# EAGLE design MaESP ESP32-C3 1.3'' OLED V1.1 (EAGLE 6.1)
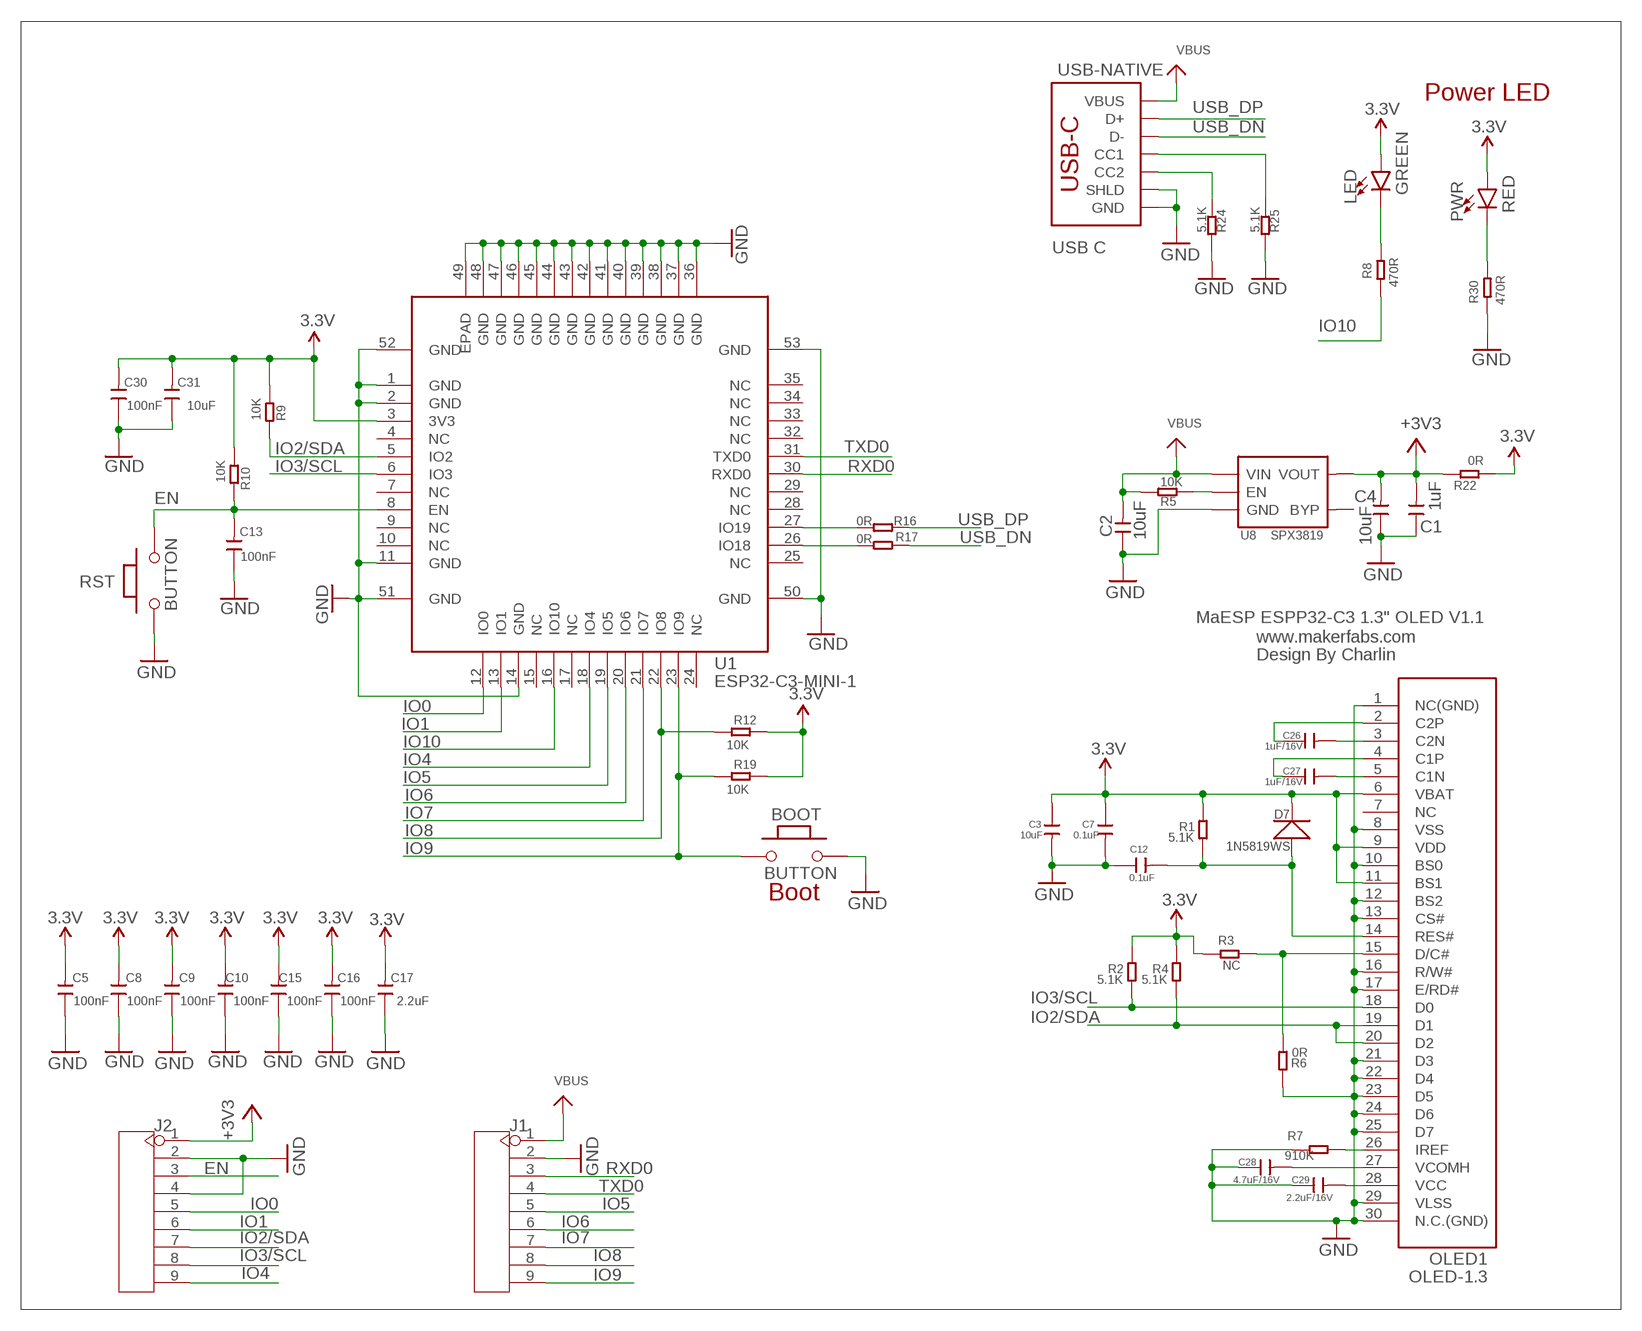
[diagram p0: schematic, sheet 1]

## Parts
BOOT  BUTTON  PB157  [157SW]
C1  1uF  C-0603  [C0603]
C2  10uF  C-0603  [C0603]
C3  10uF  C-0603  [C0603]
C4  10uF  C-0603  [C0603]
C5  100nF  C-0603  [C0603]
C7  0.1uF  C-0603  [C0603]
C8  100nF  C-0603  [C0603]
C9  100nF  C-0603  [C0603]
C10  100nF  C-0603  [C0603]
C12  0.1uF  C-0603  [C0603]
C13  100nF  C-0603  [C0603]
C15  100nF  C-0603  [C0603]
C16  100nF  C-0603  [C0603]
C17  2.2uF  C-0603  [C0603]
C26  1uF/16V  C-0603  [C0603]
C27  1uF/16V  C-0603  [C0603]
C28  4.7uF/16V  C-0603  [C0603]
C29  2.2uF/16V  C-0603  [C0603]
C30  100nF  C-0603  [C0603]
C31  10uF  C-0603  [C0603]
D7  1N5819WS  D'0805'  [SOD323]
J1  HEADER-9P-2.54  [9P-2.54]
J2  HEADER-9P-2.54  [9P-2.54]
LED  GREEN  LED-RED0603  [LED-0603]
OLED1  OLED-1.3  [OLED-1.3]
PWR  RED  LED-RED0603  [LED-0603]
R1  5.1K  R-0603  [R0603]
R2  5.1K  R-0603  [R0603]
R3  NC  R-0603  [R0603]
R4  5.1K  R-0603  [R0603]
R5  10K  R-0603  [R0603]
R6  0R  R-0603  [R0603]
R7  910K  R-0603  [R0603]
R8  470R  R-0603  [R0603]
R9  10K  R-0603  [R0603]
R10  10K  R-0603  [R0603]
R12  10K  R-0603  [R0603]
R16  0R  R-0603  [R0603]
R17  0R  R-0603  [R0603]
R19  10K  R-0603  [R0603]
R22  0R  R-0603  [R0603]
R24  5.1K  R-0603  [R0603]
R25  5.1K  R-0603  [R0603]
R30  470R  R-0603  [R0603]
RST  BUTTON  PB157  [157SW]
U1  ESP32-C3-MINI-1  [ESP32-C3-MINI-1]
U8  SPX3819  [SOT23-5]
USB-NATIVE  USB C  USB_C_4-LAYER-ISOLATED  [USB-C-16P-4LAYER-ISOLATED]

## Nets
3.3V: C3.1 C5.2 C7.1 C8.2 C9.2 C10.2 C15.2 C16.2 C17.2 C30.2 C31.2 D7.- LED.A OLED1.6(VBAT) OLED1.9(VDD) OLED1.11(BS1) PWR.A R1.2 R2.2 R3.2 R4.2 R9.1 R10.1 R12.2 R19.2 R22.1 U1.3(3V3)
3V3_EN: R5.2 U8.3(EN)
+3V3: C1.2 C4.2 J2.1 R22.2 U8.5(VOUT)
EN: C13.2 J2.3 R10.2 RST.2 U1.8(EN)
GND: BOOT.2 C1.1 C2.1 C3.2 C4.1 C5.1 C7.2 C8.1 C9.1 C10.1 C12.1 C13.1 C15.1 C16.1 C17.1 C28.1 C29.1 C30.1 C31.1 J1.2 J2.2 J2.4 OLED1.1(NC(GND)) OLED1.8(VSS) OLED1.10(BS0) OLED1.12(BS2) OLED1.13(CS#) OLED1.16(R/W#) OLED1.17(E/RD#) OLED1.21(D3) OLED1.22(D4) OLED1.23(D5) OLED1.24(D6) OLED1.25(D7) OLED1.29(VLSS) OLED1.30(N.C.(GND)) R6.2 R7.2 R24.1 R25.1 R30.2 RST.1 U1.1(GND) U1.2(GND) U1.11(GND) U1.14(GND) U1.36(GND) U1.37(GND) U1.38(GND) U1.39(GND) U1.40(GND) U1.41(GND) U1.42(GND) U1.43(GND) U1.44(GND) U1.45(GND) U1.46(GND) U1.47(GND) U1.48(GND) U1.49(EPAD) U1.50(GND) U1.51(GND) U1.52(GND) U1.53(GND) U8.2(GND) USB-NATIVE.GND USB-NATIVE.GND2(GND) USB-NATIVE.SHLD1(SHLD) USB-NATIVE.SHLD2(SHLD) USB-NATIVE.SHLD3(SHLD) USB-NATIVE.SHLD4(SHLD) USB-NATIVE.SHLD5(SHLD) USB-NATIVE.SHLD6(SHLD) USB-NATIVE.SHLD7(SHLD) USB-NATIVE.SHLD8(SHLD)
IO0: J2.5 U1.12(IO0)
IO1: J2.6 U1.13(IO1)
IO2/SDA: J2.7 OLED1.19(D1) OLED1.20(D2) R4.1 R9.2 U1.5(IO2)
IO3/SCL: J2.8 OLED1.18(D0) R2.1 U1.6(IO3)
IO4: J2.9 U1.18(IO4)
IO5: J1.5 U1.19(IO5)
IO6: J1.6 U1.20(IO6)
IO7: J1.7 U1.21(IO7)
IO8: J1.8 R12.1 U1.22(IO8)
IO9: BOOT.1 J1.9 R19.1 U1.23(IO9)
IO10: R8.2 U1.16(IO10)
N$1: LED.C R8.1
N$3: OLED1.15(D/C#) R3.1 R6.1
N$5: C28.2 OLED1.27(VCOMH)
N$7: PWR.C R30.1
N$8: C29.2 OLED1.28(VCC)
N$9: OLED1.26(IREF) R7.1
N$10: C26.2 OLED1.3(C2N)
N$11: R25.2 USB-NATIVE.A5(CC1)
N$12: R24.2 USB-NATIVE.B5(CC2)
N$13: C26.1 OLED1.2(C2P)
N$14: C27.1 OLED1.4(C1P)
N$15: C27.2 OLED1.5(C1N)
N$16: R17.1 U1.26(IO18)
N$18: R16.1 U1.27(IO19)
N$20: C12.2 D7.+ OLED1.14(RES#) R1.1
RXD0: J1.3 U1.30(RXD0)
TXD0: J1.4 U1.31(TXD0)
USB_DN: R17.2 USB-NATIVE.A7(D-) USB-NATIVE.B7(D-)
USB_DP: R16.2 USB-NATIVE.A6(D+) USB-NATIVE.B6(D+)
VBUS: C2.2 J1.1 R5.1 U8.1(VIN) USB-NATIVE.VBUS1(VBUS) USB-NATIVE.VBUS2(VBUS)
Unconnected: OLED1.7(NC) U1.4(NC) U1.7(NC) U1.9(NC) U1.10(NC) U1.15(NC) U1.17(NC) U1.24(NC) U1.25(NC) U1.28(NC) U1.29(NC) U1.32(NC) U1.33(NC) U1.34(NC) U1.35(NC) U8.4(BYP)

## Notes on the sheet
- Power LED
- MaESP ESPP32-C3 1.3" OLED V1.1
- www.makerfabs.com
- Design By Charlin
- Boot

## Library data of the parts
BOOT RST = MySMD:PB157
C1-C5 C7-C10 C12 C13 C15-C17 C26-C31 = Discrete:C*: Ceramic Capacitors
D7 = Discrete:D*
J1 J2 = Connector:HEADER-9P
LED = SparkFun-LED:LED-RED: Red SMD LED Used in manufacturing of most products at SparkFun Packages: 0603 - SMD 0603 package [Product Link] <http://docs.avagotech.com/docs/AV02-0551EN> 0603 SMART - SMD 0603 SMART package ( more efficient and expensive)[Product Link] <http://www.osram-os.com/Graphics/XPic2/00077099_0.pdf> 1206 - SMD1206 package [Product Link] <https://www.sparkfun.com/datasheets/DevTools/LilyPad/Q150OVS4.pdff> SparkFun Products: Pro Mini 328 -5V <https://www.sparkfun.com/products/821> RedBoard <https://www.sparkfun.com/products/12757> IOIO-OTG <https://www.sparkfun.com/products/13613>; PROD_ID: DIO-00819; VALUE: RED
OLED1 = OLED:OLED-1.3
PWR = SparkFun-LED:LED-RED: Red SMD LED Used in manufacturing of most products at SparkFun Packages: 0603 - SMD 0603 package [Product Link] <http://docs.avagotech.com/docs/AV02-0551EN> 0603 SMART - SMD 0603 SMART package ( more efficient and expensive)[Product Link] <http://www.osram-os.com/Graphics/XPic2/00077099_0.pdf> 1206 - SMD1206 package [Product Link] <https://www.sparkfun.com/datasheets/DevTools/LilyPad/Q150OVS4.pdff> SparkFun Products: Pro Mini 328 -5V <https://www.sparkfun.com/products/821> RedBoard <https://www.sparkfun.com/products/12757> IOIO-OTG <https://www.sparkfun.com/products/13613>; PROD_ID: DIO-00819
R1-R10 R12 R16 R17 R19 R22 R24 R25 R30 = Discrete:R*
U1 = self:ESP32-C3-MINI-1
U8 = IC:SPX3819
USB-NATIVE = SparkFun-Connectors:USB_C: USB Type C 16Pin Connector Super Speed pins not available on the 16-pin purely SMD connector so this part is best for USB 2.0 implementations. D1 and D2 are tied together enabling D+/- no matter which way the cable is plugged into the connector. The two channel configuration pins (CC1/2) are exposed. These are normally connected to ground via 5.1k resistors but can be reconfigured for high current/high power applications. **4-LAYER BOARD WARNING!!** If designing 4-layer board, make sure to select the variant _4-LAYER-ISOLATED. The linked footprint (USB-C-16-4LAYER-ISOLATED) includes some very necessary cutout polygons in the inner layers (2 and 15). This prevents the PTH mounting shield legs on the USB connector from electrically connecting any other polygons on the inner layers (usually VCC and GND).; PROD_ID: CONN-14122; VALUE: USB Female Type C Connector

## Net classes
0 default: width 0.203 mm, drill 0.305 mm, clearance 0.152 mm
2 Clock: width 0.089 mm, clearance 0.178 mm

## Board
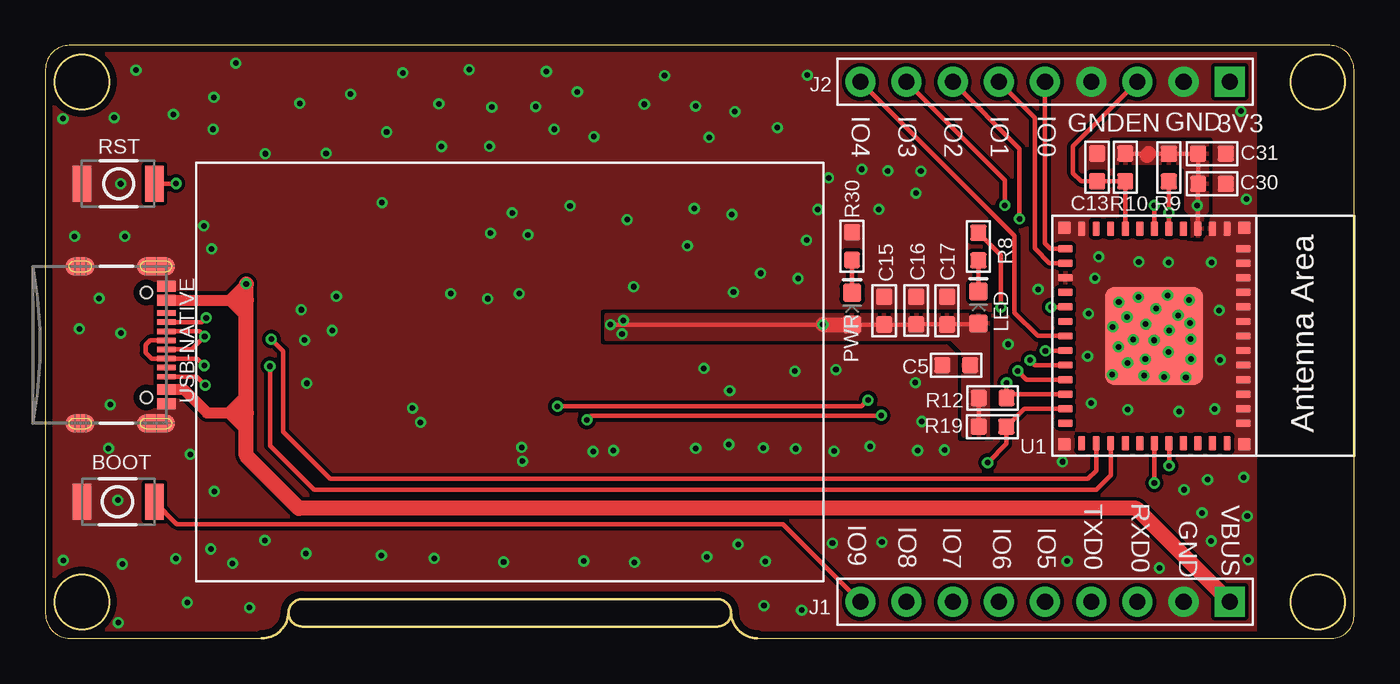
[diagram p1: board, top side]
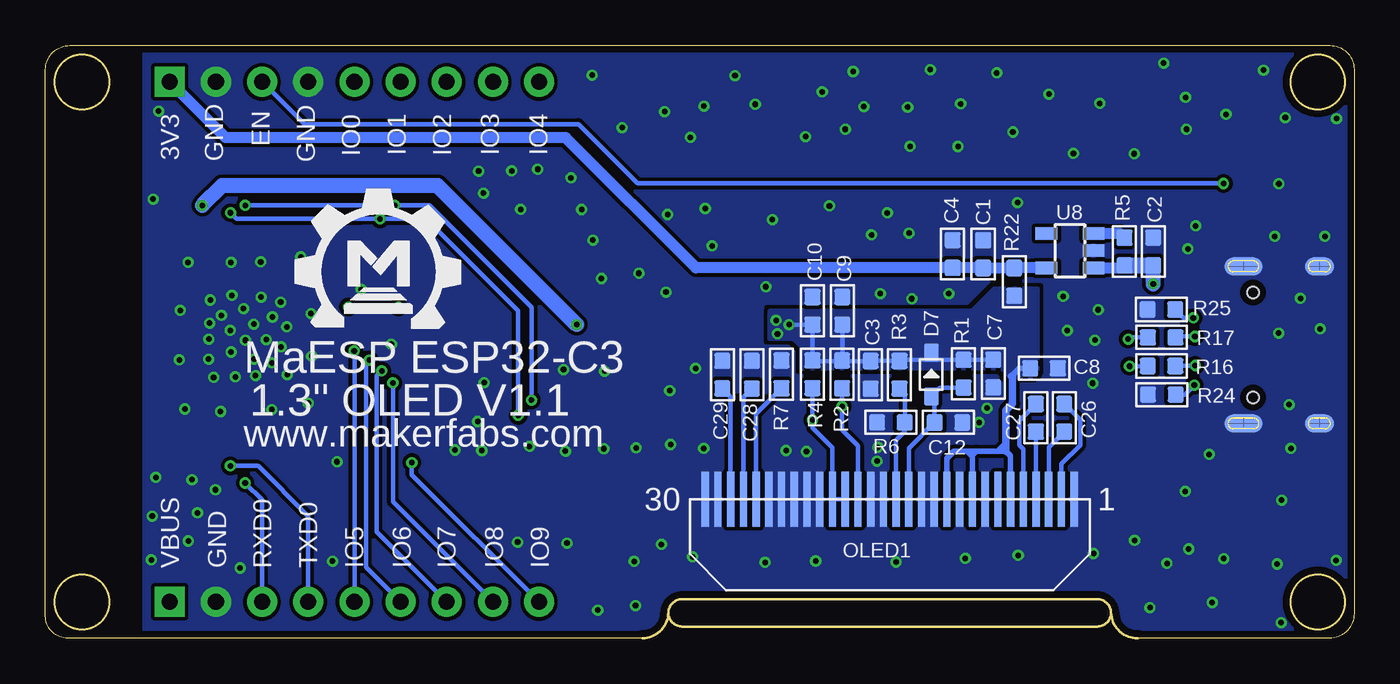
[diagram p2: board, bottom side, seen from below]

Size 72 x 32.6 mm. Coordinates in mm from the lower left corner, seen from the top.
Outline: 13.37,1.42 arc-90 11.89,0 1.35,0 arc-90 0,1.35 0,31.28 arc-90 1.32,32.6 70.66,32.6 arc-90 72,31.26 72,1.22 arc-90 70.78,0 39.15,0 arc-90 37.73,1.42
Outline: circle at 2,2 radius 1.5
Outline: circle at 2,30.6 radius 1.5
Outline: circle at 70,30.6 radius 1.5
Outline: circle at 70,2 radius 1.5
Copper layers (1*16): Top 0.035mm / dielectric 1.5mm / Bottom 0.035mm
Design rules: minimum track width 10mil, minimum drill 8mil, track to track 8mil, track to pad 8mil, pad to pad 8mil, via to via 8mil, smd to smd 0mil, copper to edge 15mil, drill to drill 8mil, minimum pad ring 10mil, minimum via ring 6mil, stop-mask expansion 4mil, vias tented up to drill 100mil, thermal gap 0mil
tRestrict: area 66.7,0 to 72,32.6
bRestrict: area 66.7,0 to 72,32.6

### Footprints (pad centres in the part's own frame; a part is rotated, then mirrored left to right if it is on the bottom)
157SW = smd 1.016 x 1.981: 1 0,0; 2 4,0
C0603 = smd 0.889 x 0.889: 1 -0.762,0; 2 0.762,0
SOD323 = smd 1 x 0.8: + -1.2,0; - 1.2,0
9P-2.54 = drill 0.889 pad 1.651 square: 1 0,10.16 | drill 0.889 pad 1.651: 2 0,7.62; 3 0,5.08; 4 0,2.54; 5 0,0; 6 0,-2.54; 7 0,-5.08; 8 0,-7.62; 9 0,-10.16
LED-0603 = smd 1 x 1: A -0.877,0; C 0.877,0
OLED-1.3 = smd 0.4 x 3 bottom: 1 -10.15,-7; 2 -9.45,-7; 3 -8.75,-7; 4 -8.05,-7; 5 -7.35,-7; 6 -6.65,-7; 7 -5.95,-7; 8 -5.25,-7; 9 -4.55,-7; 10 -3.85,-7; 11 -3.15,-7; 12 -2.45,-7; 13 -1.75,-7; 14 -1.05,-7; 15 -0.35,-7; 16 0.35,-7; 17 1.05,-7; 18 1.75,-7; 19 2.45,-7; 20 3.15,-7; 21 3.85,-7; 22 4.55,-7; 23 5.25,-7; 24 5.95,-7; 25 6.65,-7; 26 7.35,-7; 27 8.05,-7; 28 8.75,-7; 29 9.45,-7; 30 10.15,-7
R0603 = smd 0.889 x 0.889: 1 -0.762,0; 2 0.762,0
ESP32-C3-MINI-1 = smd 0.8 x 0.4: 1 -5.9,1.3; 2 -5.9,0.5; 3 -5.9,-0.3; 4 -5.9,-1.1; 5 -5.9,-1.9; 6 -5.9,-2.7; 7 -5.9,-3.5; 8 -5.9,-4.3; 9 -5.9,-5.1; 10 -5.9,-5.9; 11 -5.9,-6.7; 25 5.9,-6.7; 26 5.9,-5.9; 27 5.9,-5.1; 28 5.9,-4.3; 29 5.9,-3.5; 30 5.9,-2.7; 31 5.9,-1.9; 32 5.9,-1.1; 33 5.9,-0.3; 34 5.9,0.5; 35 5.9,1.3 | smd 0.4 x 0.8: 12 -4.8,-7.6; 13 -4,-7.6; 14 -3.2,-7.6; 15 -2.4,-7.6; 16 -1.6,-7.6; 17 -0.8,-7.6; 18 0,-7.6; 19 0.8,-7.6; 20 1.6,-7.6; 21 2.4,-7.6; 22 3.2,-7.6; 23 4,-7.6; 24 4.8,-7.6; 36 4.8,2.2; 37 4,2.2; 38 3.2,2.2; 39 2.4,2.2; 40 1.6,2.2; 41 0.8,2.2; 42 0,2.2; 43 -0.8,2.2; 44 -1.6,2.2; 45 -2.4,2.2; 46 -3.2,2.2; 47 -4,2.2; 48 -4.8,2.2 | smd 5.4 x 5.4: 49 0,-2.7 | smd 0.7 x 0.7: 50 -5.95,2.25; 51 -5.95,-7.65; 52 5.95,2.25; 53 5.95,-7.65
SOT23-5 = smd 0.69 x 1.2: 1 -0.95,-1.3; 2 0,-1.3; 3 0.95,-1.3; 4 0.95,1.3; 5 -0.95,1.3
USB-C-16P-4LAYER-ISOLATED = smd 0.3 x 1: A5 -1.25,-0.34; A6 -0.25,-0.34; A7 0.25,-0.34; A8 1.25,-0.34; B5 1.75,-0.34; B6 0.75,-0.34; B7 -0.75,-0.34; B8 -1.75,-0.34 | smd 0.6 x 1: GND -3.225,-0.34; GND2 3.225,-0.34; VBUS1 -2.45,-0.34; VBUS2 2.45,-0.34 | smd 1 x 2.1: SHLD1 -4.32,-0.915; SHLD2 4.32,-0.915 | smd 1 x 2.1 bottom: SHLD3 -4.32,-0.915; SHLD4 4.32,-0.915 | smd 1 x 1.6: SHLD5 -4.32,-5.095; SHLD8 4.32,-5.095 | smd 1 x 1.6 bottom: SHLD6 -4.32,-5.095; SHLD7 4.32,-5.095 | hole 0.65: -2.89,-1.445; 2.89,-1.445

### Placement (x,y rotation side)
BOOT  6,7.5 180 top
C1  20.41,21.13 270 bottom
C2  11.05,21.27 270 bottom
C3  26.6,14.48 270 bottom
C4  22.09,21.13 270 bottom
C5  50.11,15.02 0 top
C7  19.85,14.55 270 bottom
C8  17.05,14.85 180 bottom
C9  28.16,18.01 270 bottom
C10  29.8,18.01 270 bottom
C12  22.32,11.87 180 bottom
C13  57.86,25.9 270 top
C15  46.15,18.01 270 top
C16  47.91,18.02 270 top
C17  49.61,18.02 270 top
C26  15.94,12.12 270 bottom
C27  17.51,12.12 90 bottom
C28  33.13,14.49 270 bottom
C29  34.75,14.49 270 bottom
C30  64.18,24.99 180 top
C31  64.18,26.65 180 top
D7  23.26,14.5 90 bottom
J1  55,2 270 top
J2  55,30.6 270 top
LED  51.33,18.19 90 top
OLED1  25.55,14.64 0 top
PWR  44.38,18.13 90 top
R1  21.49,14.54 90 bottom
R2  28.17,14.51 90 bottom
R3  25.01,14.48 90 bottom
R4  29.8,14.51 90 bottom
R5  12.63,21.26 90 bottom
R6  25.48,11.87 180 bottom
R7  31.5,14.51 90 bottom
R8  51.33,21.54 90 top
R9  61.81,25.88 270 top
R10  59.41,25.9 270 top
R12  52.11,13.21 180 top
R16  10.59,14.97 0 bottom
R17  10.59,16.54 0 bottom
R19  52.11,11.63 180 top
R22  18.7,19.6 90 bottom
R24  10.58,13.4 0 bottom
R25  10.6,18.08 0 bottom
R30  44.38,21.56 90 top
RST  2,25 0 top
U1  63.71,16.62 270 top
U8  15.63,21.31 90 bottom
U$1  [MAKERFABS_0.3]  57.8,17.09 0 bottom
USB-NATIVE  7,16.13 270 top

### Tracks (layer width: path | path; a pad name or v marks a point on that pad's centre or on a via)
3.3V  (via drill 0.3)
  Top 0.254: PWR.A C15.2 C16.2 C17.2 51.34,17.25 | U1.3 63.41,24.98 C30.2 C31.2 R9.1 61.8,26.66 60.71,26.66 R10.1 60.62,26.66 | v31.09,17.25 v42.77,17.25 | R19.2 R12.2
  Top 0.813: v42.77,17.25 PWR.A | 60.6,26.55 60.71,26.66
  Bottom 0.254: C7.1 21.48,15.32 R1.2 23.42,15.3 | C3.1 R3.2 24.95,15.3 23.42,15.3 | D7.- 23.26,15.46 23.42,15.3 | C3.1 29.77,15.24 R4.2 C10.2 v31.09,17.24 v31.09,17.25 | C9.2 28.16,15.29 R2.2 28.14,15.24 C3.1
  Bottom 0.305: OLED1.6 18.9,10.04 19.15,10.29 19.58,10.29 | C8.2 18.4,14.85 18.85,14.4 | OLED1.9 21,10.09 20.8,10.29 | 20.8,10.29 19.58,10.29 | 21.29,10.29 20.8,10.29 | 21.01,10.01 21.29,10.29 | OLED1.11 22.4,9.91 22.02,10.29 21.29,10.29 | 19.15,10.72 19.58,10.29
  Bottom 0.406: 19.15,10.29 19.15,12.55 18.8,12.9 18.8,14.35 18.85,14.4
  Bottom 0.813: v42.77,17.25 50.42,24.89 62.28,24.89 v63.37,23.8
  other vias: 31.8,17.48 31.72,16.74
  pour Bottom: 17.42,18 32.13,18 32.16,17.75 32.16,16.46 30.84,16.46 30.4,16.03 30.4,14.83 19.38,14.83 18.92,14.38 17.42,14.38
  pour Top: 51.84,11.15 51.84,17.75 30.86,17.75 30.86,16.46 49.89,16.46 50.5,15.85 50.5,11.15
  pour Top: 63.63,22.12 63.63,23.24 63.91,23.52 63.91,27.23 58.88,27.23 58.88,26.16 62.43,26.16 62.76,25.83 62.76,23.6 63.09,23.27 63.09,22.12
  pour Bottom: 17.42,17.63 17.42,19.23 19.79,19.23 21.01,18.01 21.01,17.63
3V3_EN
  Bottom 0.61: U8.3 12.87,22.26 R5.2
+3V3
  Bottom 0.61: U8.5 R22.2 C1.2 C4.2 36.22,20.37 43.38,27.53 62.09,27.53 J2.1
EN  (via drill 0.3)
  Top 0.254: U1.8 R10.2 C13.2 | C13.2 56.98,25.13 56.54,25.58 56.54,27.06 J2.3 | C13.2 | RST.2 v7.17,25 v7.18,25.01
  Bottom 0.254: v7.18,25.01 39.41,25.01 42.67,28.27 57.75,28.27 J2.3
GND  (via drill 0.3)
  other vias: 25.21,4.19 39.61,4.22 12.08,5.38 10.3,4.11 1.87,17.01 42.49,23.58 47.9,24.48 37.77,23.3 66.07,24.14 41.88,21.89 18.48,4.56 3.48,10.44 57.95,20.98 58.72,17.12 59.84,16.42 62.97,17.33 35.77,29.27 39.53,1.79 62.93,18.6 60.44,14.44 61,16.39 58.69,14.49 26.2,10.49 61.55,14.37 64.34,12.61 62.32,17.76 61.1,18.12 63.01,16.45 59.51,17.67 3.57,12.84 21.65,29.38 4.23,4.08 61.83,16.93 60.14,18.75 59.03,16.03 43.08,25.32 60.53,17.27 3.99,7.59 62.74,14.35 63.03,15.35 41.61,1.55 35.78,10.44 32.4,4.17 61.74,18.85 61.78,15.74 60.52,15.35 21.79,27.04 59.54,15.14 0.99,4.28 36.4,4.48 32,23.02 4.01,0.86 28.86,23.78 36.52,27.55 41.41,19.78 2.96,18.69 21.39,4.38 43.3,5.22 46.35,25.7 31.25,10.32 35.32,21.58 45.37,10.55 59.06,18.48 18.52,23.95 23.32,31.27 19.66,31.09 27.56,31.17 29.26,30.05 34.06,30.94 16.79,29.92 24.56,29.21 24.43,27.05 27.99,27.99 26.97,29.24 30.18,27.58 22.3,18.95 26.06,18.95 9.14,21.41 9.22,27.99 4.14,24.99 4.37,22.1 1.6,22.1 4.98,31.24 3.78,28.63 0.97,28.57 60.16,20.7 61.79,20.67 64.15,20.67 64.58,18.03 64.63,15.31 62.37,12.47 59.55,12.57 57.54,12.92 57.34,15.51 57.39,17.85 57.75,19.81 65.77,28.99 37.86,19.04 45.86,23.58 35.7,23.63 48.17,25.69 41.23,14.69 49.46,10.35 54.62,19.19 36.23,14.84 43.49,14.77 47.86,14.06 7.17,4.38 63.64,6.89 63.94,8.72 14.34,4.66 62.65,8.16 66.18,4.3 64.14,5.34 66.13,6.72 65.92,8.85 47.99,10.32 37.6,10.65 48.21,11.92 15.78,16.92 26.55,22.18 20.2,12.65 44.92,25.79 40.27,28.08 32.95,29.37 37.93,28.96 41.92,30.97 10.47,31.63 7.04,28.81 8.71,22.68 12.09,26.64 4.15,16.78 20.63,11.87 26.24,9.73 30.13,10.27 39.5,10.47 37.65,13.62 39.35,20.07 38.11,5.16 43.39,10.29 41.28,10.42 29.62,4.25 11.23,1.68 7.8,1.96 9.1,4.91 24.33,18.67 24.49,22.28 32.36,19.33 14.38,14.02 46.02,5.28 56.21,4.24 61.29,3.86 55.96,9.7 18.77,27.84 25.68,23.39 15.44,26.67 14,29.41 9.27,29.74 52.97,16.17 14.08,18.06 14.25,16.39 16.01,18.8 7.97,10.11 9.29,8.07
  pour Top (rank 6): -1.27,37.36 75.44,37.36 75.44,-3.17 -1.27,-3.17
  pour Bottom (rank 6): -2.54,35.56 76.2,35.56 76.2,-2.54 -2.54,-2.54
IO0
  Top 0.254: J2.5 55,21.71 55.3,21.41 U1.12
IO1
  Top 0.254: U1.13 55.25,20.62 54.43,21.44 54.43,28.63 J2.6
IO2/SDA  (via drill 0.3)
  Top 0.254: R9.2 U1.5 v61.81,23.4 | v29.79,12 30.03,12.24 v45.99,12.24 v45.99,12.25 | J2.7 53.59,26.93 v53.59,23.06
  Bottom 0.254: OLED1.19 OLED1.20 28.7,10.46 29.8,11.56 | 29.8,11.56 R4.1 | 29.8,11.56 29.79,11.57 v29.79,12 | v45.99,12.25 45.99,18 51.05,23.06 v53.59,23.06 54.69,23.06 61.48,23.06 v61.81,23.4
IO3/SCL  (via drill 0.3)
  Top 0.254: v28.17,12.75 44.91,12.75 v45.26,13.1 | U1.6 v61.01,23.8 v61.01,23.81 | J2.8 52.78,25.2 v52.78,23.81
  Bottom 0.254: OLED1.18 27.3,10.59 28.17,11.46 R2.1 v28.17,12.75 | v45.26,13.1 45.26,18.21 50.86,23.81 v52.78,23.81 53.34,23.81 v61.01,23.81
IO4
  Top 0.254: 56.1,16.61 U1.18 54.6,16.62 53.31,17.91 53.31,22.12 J2.9
IO5  (via drill 0.3)
  Top 0.254: v55.02,15.8 56.09,15.8 U1.19
  Bottom 0.254: J1.5 55,15.78 v55.02,15.8
IO6  (via drill 0.3)
  Top 0.254: U1.20 54.45,15.02 v54.18,15.29
  Bottom 0.254: J1.6 54.36,3.9 54.36,15.11 v54.18,15.29
IO7  (via drill 0.3)
  Top 0.254: U1.21 53.98,14.22 v53.49,14.71
  Bottom 0.254: J1.7 53.77,5.85 53.77,14.43 v53.49,14.71
IO8  (via drill 0.3)
  Top 0.254: v52.88,14.05 52.88,14.04 R12.1 53.09,13.42 U1.22
  Bottom 0.254: J1.8 52.88,7.5 v52.88,14.05
IO9  (via drill 0.3)
  Top 0.254: U1.23 53.86,12.62 R19.1 | 52.86,11.62 R19.1 | J1.9 40.57,6.27 7.23,6.27 BOOT.1 | v51.84,9.65 52.87,10.68 R19.1
  Bottom 0.254: J1.9 51.84,9 v51.84,9.65
IO10  (via drill 0.3)
  Top 0.254: R8.2 52.58,21.06 v52.58,18.21 | v55.32,18.21 56.1,18.21 U1.16
  Bottom 0.254: v52.58,18.21 v55.32,18.21
N$1
  Top 0.254: LED.C R8.1
N$3
  Bottom 0.254: R3.1 24.72,13.43 R6.1 24.72,11.37 25.2,10.89 OLED1.15
N$5
  Bottom 0.254: OLED1.27 33.6,13.26 C28.2
N$7
  Top 0.254: PWR.C R30.1
N$8
  Bottom 0.254: OLED1.28 34.3,13.28 C29.2
N$9
  Bottom 0.254: OLED1.26 32.9,12.35 R7.1
N$10
  Bottom 0.254: OLED1.3 16.8,10.5 C26.2
N$11  (via drill 0.3)
  Top 0.254: USB-NATIVE.A5 8.6,17.38 v8.84,17.62
  Bottom 0.254: R25.2 9.38,17.62 v8.84,17.62
N$12  (via drill 0.3)
  Top 0.254: USB-NATIVE.B5 8.32,14.38 v8.79,13.91
  Bottom 0.254: R24.2 9.31,13.4 v8.79,13.91
N$13
  Bottom 0.254: OLED1.2 16.1,9.58 15.06,10.62 15.06,12 C26.1
N$14
  Bottom 0.254: OLED1.4 17.5,11.35 C27.1
N$15
  Bottom 0.254: OLED1.5 18.2,10.4 18.41,10.62 18.41,11.97 C27.2
N$16  (via drill 0.3)
  Top 0.254: U1.26 57.81,9.21 57.35,8.76 15.67,8.76 13.08,11.34 13.08,15.79 v12.42,16.45
  Bottom 0.254: R17.1 12.33,16.54 v12.42,16.45
N$18  (via drill 0.3)
  Top 0.254: U1.27 58.61,8.96 57.81,8.16 14.78,8.16 12.35,10.59 v12.35,14.96
  Bottom 0.254: R16.1 v12.34,14.97 v12.35,14.96
N$20
  Bottom 0.254: R1.1 22.78,13.78 D7.+ 23.08,13.12 C12.2 24.5,10.44 OLED1.14
RXD0  (via drill 0.3)
  Top 0.254: U1.30 v61.01,8.53
  Bottom 0.254: J1.3 60.08,7.6 v61.01,8.53
TXD0  (via drill 0.3)
  Top 0.254: U1.31 61.82,10.71 v61.82,9.47
  Bottom 0.254: J1.4 57.54,6.71 60.3,9.47 v61.82,9.47
USB_DN  (via drill 0.3)
  Top 0.254: USB-NATIVE.A7 8.05,15.88 v8.76,16.59 8.47,16.88 USB-NATIVE.B7
  Bottom 0.254: v8.76,16.59 9.77,16.59 R17.2
USB_DP  (via drill 0.3)
  Top 0.254: v8.74,15 8.36,15.38 USB-NATIVE.B6 6.65,15.37 5.84,15.37 5.51,15.7 5.51,16.13 5.76,16.38 USB-NATIVE.A6
  Bottom 0.254: v8.74,15 9.8,15 R16.2
VBUS  (via drill 0.3)  (1 unrouted)
  Top 0.61: USB-NATIVE.VBUS2 7.61,13.68 8.89,12.39 10.08,12.39 | 10.08,12.39 11.04,12.39 | USB-NATIVE.VBUS1 11.03,18.58 11.04,18.59 | 11.05,11.43 10.08,12.39 | 10.08,12.39 11.05,13.36 | 11.05,19.51 10.13,18.59 11.05,17.68
  Top 0.813: J1.1 60.02,7.14 13.95,7.14 11.04,10.04 11.04,12.39 11.04,18.59 v11.04,19.49
  Bottom 0.61: U8.1 11.19,20.36 C2.2
  Bottom 0.813: v11.04,19.49 C2.2 R5.1

### Text on the board
tPlace: IO4 | IO3 | IO2 | IO1 | IO0 | GND | EN | GND | 3V3 | TXD0 | RXD0 | VBUS | IO9 | IO8 | IO7 | IO6 | IO5 | GND
bPlace: IO4 | IO3 | IO2 | IO1 | IO0 | EN | GND | GND | 3V3 | MaESP ESP32-C3 | 1.3" OLED V1.1 | www.makerfabs.com | IO9 | IO8 | IO7 | IO6 | IO5 | TXD0 | RXD0 | GND | VBUS